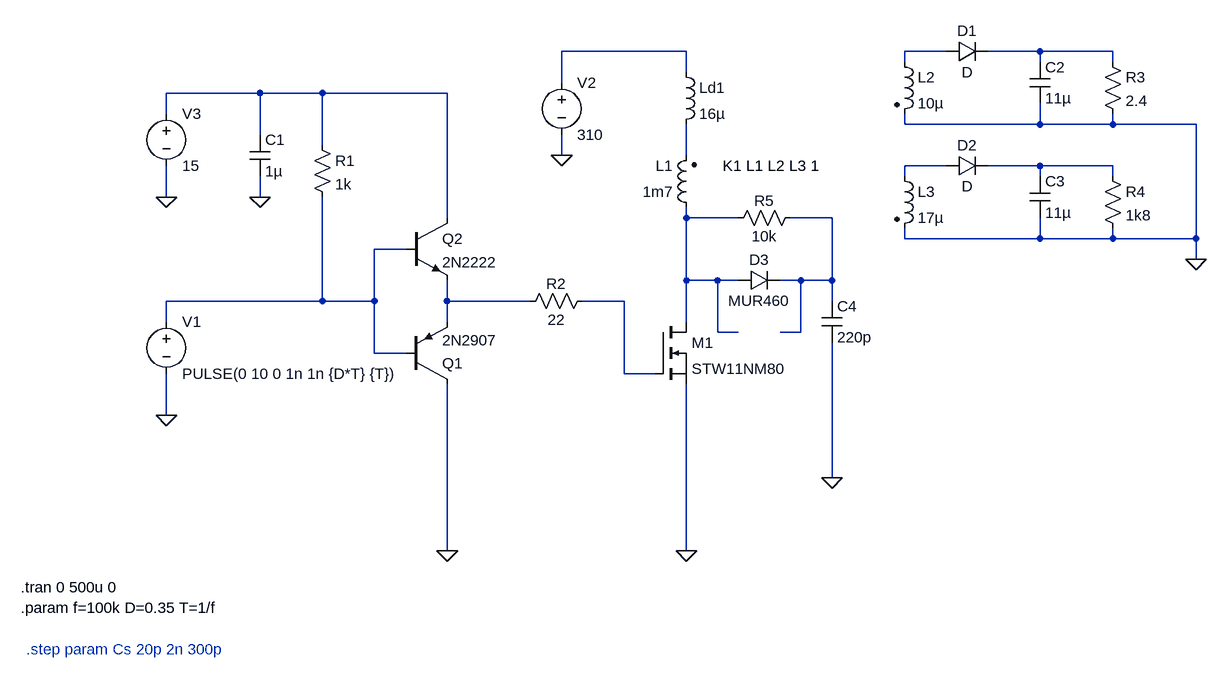
[diagram p0: schematic Draft2.asc]
Draft2.asc, the LTspice schematic file:
Version 4
SHEET 1 1140 680
WIRE 336 -288 144 -288
WIRE 736 -288 672 -288
WIRE 880 -288 800 -288
WIRE 992 -288 880 -288
WIRE 672 -272 672 -288
WIRE 880 -272 880 -288
WIRE 992 -272 992 -288
WIRE 336 -256 336 -288
WIRE 144 -240 144 -288
WIRE -320 -224 -464 -224
WIRE -224 -224 -320 -224
WIRE -32 -224 -224 -224
WIRE -464 -192 -464 -224
WIRE 672 -176 672 -192
WIRE 880 -176 880 -208
WIRE 880 -176 672 -176
WIRE 992 -176 992 -192
WIRE 992 -176 880 -176
WIRE 1120 -176 992 -176
WIRE -320 -160 -320 -224
WIRE -224 -144 -224 -224
WIRE 144 -128 144 -160
WIRE 336 -128 336 -176
WIRE 736 -112 672 -112
WIRE 880 -112 800 -112
WIRE 992 -112 880 -112
WIRE 672 -96 672 -112
WIRE 880 -96 880 -112
WIRE 992 -96 992 -112
WIRE -464 -64 -464 -112
WIRE -320 -64 -320 -96
WIRE -32 -32 -32 -224
WIRE 336 -32 336 -48
WIRE 416 -32 336 -32
WIRE 560 -32 496 -32
WIRE 672 0 672 -16
WIRE 880 0 880 -32
WIRE 880 0 672 0
WIRE 992 0 992 -16
WIRE 992 0 880 0
WIRE 1120 0 1120 -176
WIRE 1120 0 992 0
WIRE -96 16 -144 16
WIRE 1120 32 1120 0
WIRE 336 64 336 -32
WIRE 384 64 336 64
WIRE 416 64 384 64
WIRE 512 64 480 64
WIRE 560 64 560 -32
WIRE 560 64 512 64
WIRE -224 96 -224 -64
WIRE -224 96 -464 96
WIRE -144 96 -144 16
WIRE -144 96 -224 96
WIRE -32 96 -32 64
WIRE 96 96 -32 96
WIRE 240 96 176 96
WIRE 560 96 560 64
WIRE -464 128 -464 96
WIRE -32 128 -32 96
WIRE 336 128 336 64
WIRE 384 144 384 64
WIRE 416 144 384 144
WIRE 512 144 512 64
WIRE 512 144 480 144
WIRE -144 176 -144 96
WIRE -96 176 -144 176
WIRE 240 208 240 96
WIRE 288 208 240 208
WIRE -464 272 -464 208
WIRE 560 368 560 160
WIRE -32 480 -32 224
WIRE 336 480 336 224
FLAG -320 -64 0
FLAG 144 -128 0
FLAG -464 -64 0
FLAG -464 272 0
FLAG -32 480 0
FLAG 336 480 0
FLAG 560 368 0
FLAG 1120 32 0
SYMBOL pnp -96 224 M180
SYMATTR InstName Q1
SYMATTR Value 2N2907
SYMBOL npn -96 -32 R0
SYMATTR InstName Q2
SYMATTR Value 2N2222
SYMBOL voltage -464 112 R0
WINDOW 123 0 0 Left 0
WINDOW 39 0 0 Left 0
SYMATTR InstName V1
SYMATTR Value PULSE(0 10 0 1n 1n {D*T} {T})
SYMBOL res -240 -160 R0
SYMATTR InstName R1
SYMATTR Value 1k
SYMBOL cap -336 -160 R0
SYMATTR InstName C1
SYMATTR Value 1µ
SYMBOL res 80 112 R270
WINDOW 0 27 56 VTop 2
WINDOW 3 3 56 VBottom 2
SYMATTR InstName R2
SYMATTR Value 22
SYMBOL nmos 288 128 R0
SYMATTR InstName M1
SYMATTR Value STW11NM80
SYMBOL voltage 144 -256 R0
WINDOW 123 0 0 Left 0
WINDOW 39 0 0 Left 0
SYMATTR InstName V2
SYMATTR Value 310
SYMBOL voltage -464 -208 R0
WINDOW 123 0 0 Left 0
WINDOW 39 0 0 Left 0
SYMATTR InstName V3
SYMATTR Value 15
SYMBOL cap 864 -272 R0
SYMATTR InstName C2
SYMATTR Value 11µ
SYMBOL res 976 -288 R0
SYMATTR InstName R3
SYMATTR Value 2.4
SYMBOL ind2 352 -32 R180
WINDOW 3 36 40 Left 2
WINDOW 0 36 80 Left 2
SYMATTR Value 1m7
SYMATTR InstName L1
SYMATTR Type ind
SYMBOL ind2 656 -288 R0
SYMATTR Value 10µ
SYMATTR InstName L2
SYMATTR Type ind
SYMBOL cap 864 -96 R0
SYMATTR InstName C3
SYMATTR Value 11µ
SYMBOL res 976 -112 R0
SYMATTR InstName R4
SYMATTR Value 1k8
SYMBOL ind2 656 -112 R0
SYMATTR Value 17µ
SYMATTR InstName L3
SYMATTR Type ind
SYMBOL cap 544 96 R0
SYMATTR InstName C4
SYMATTR Value 220p
SYMBOL res 400 -16 R270
WINDOW 0 27 56 VTop 2
WINDOW 3 3 56 VBottom 2
SYMATTR InstName R5
SYMATTR Value 10k
SYMBOL ind 320 -272 R0
SYMATTR Value 16µ
SYMATTR InstName Ld1
SYMBOL diode 736 -272 R270
WINDOW 0 32 32 VTop 2
WINDOW 3 0 32 VBottom 2
SYMATTR InstName D1
SYMBOL diode 736 -96 R270
WINDOW 0 32 32 VTop 2
WINDOW 3 0 32 VBottom 2
SYMATTR InstName D2
SYMBOL diode 416 80 R270
WINDOW 0 32 32 VTop 2
WINDOW 3 0 32 VBottom 2
SYMATTR InstName D3
SYMATTR Value MUR460
TEXT -688 568 Left 2 !.param f=100k D=0.35 T=1/f
TEXT -688 536 Left 2 !.tran 0 500u 0
TEXT 392 -112 Left 2 !K1 L1 L2 L3 1
TEXT -680 632 Left 2 ;.step param Cs 20p 2n 300p

The netlist it stands for:
* Draft2.asc
Q1 0 N010 N011 0 2N2907
Q2 N004 N010 N011 0 2N2222
V1 N010 0 PULSE(0 10 0 1n 1n {D*T} {T})
R1 N004 N010 1k
C1 N004 0 1µ
R2 N011 N012 22
M1 N008 N012 0 0 STW11NM80
V2 N001 0 310
V3 N004 0 15
C2 N003 0 11µ
R3 N003 0 2.4
L1 N008 N005 1m7
L2 N002 0 10µ
C3 N007 0 11µ
R4 N007 0 1k8
L3 N006 0 17µ
C4 N009 0 220p
R5 N008 N009 10k
Ld1 N001 N005 16µ
D1 N002 N003 D
D2 N006 N007 D
D3 N008 N009 MUR460
.model D D
.lib standard.dio
.model NPN NPN
.model PNP PNP
.lib standard.bjt
.model NMOS NMOS
.model PMOS PMOS
.lib standard.mos
.param f=100k D=0.35 T=1/f
.tran 0 500u 0
K1 L1 L2 L3 1
* .step param Cs 20p 2n 300p
.backanno
.end